# Altium schematic sheet 简单版.SchDoc
size A4
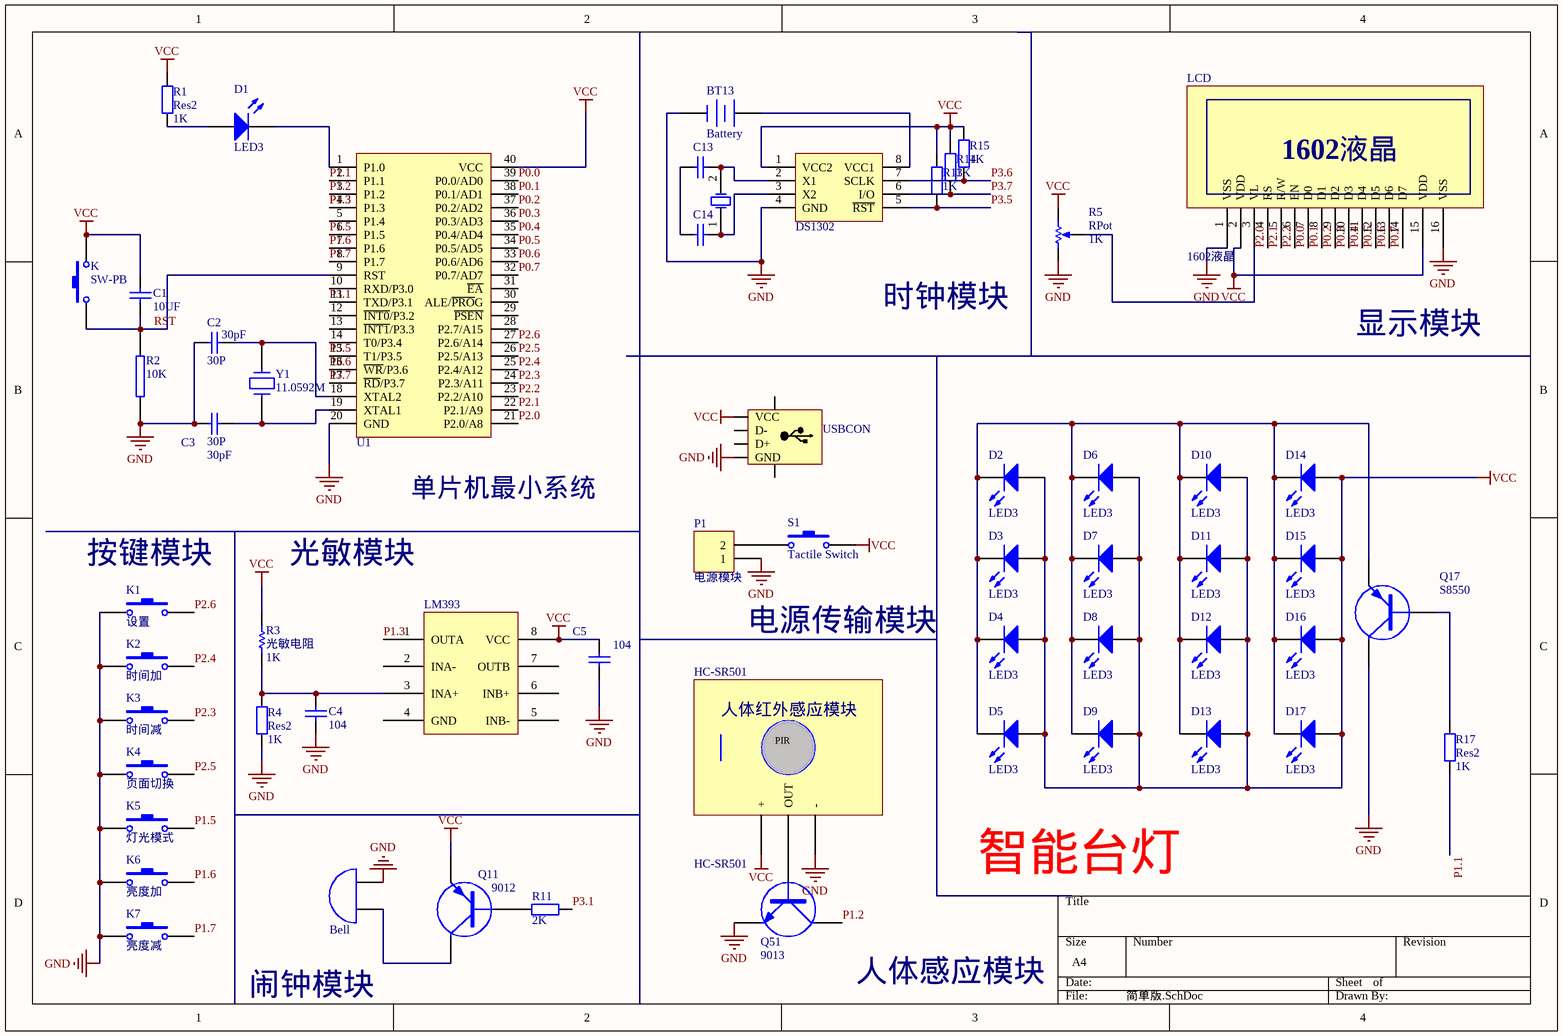
[diagram p0: 简单版.SchDoc]

## Parts
BEEP  Bell  [Beep_small]
BT13  Battery  [Battery_3V固定底座]
C1  10UF  [CAPPR2.5-6.3X5]
C2  30P  value 30pF  [Capacitor-Disk-Large]
C3  30P  value 30pF  [Capacitor-Disk-Large]
C4  104  [CAPPR2.5-6.3X5]
C5  104  [CAPPR2.5-6.3X5]
C13  Cap  [CAP-0.1]  (value not drawn)
C14  Cap  [CAP-0.1]  (value not drawn)
D1  LED3  [LED-R3-H5-SINGLE-R]
D2  LED3  [3.5X2.8X1.9]
D3  LED3  [3.5X2.8X1.9]
D4  LED3  [3.5X2.8X1.9]
D5  LED3  [3.5X2.8X1.9]
D6  LED3  [3.5X2.8X1.9]
D7  LED3  [3.5X2.8X1.9]
D8  LED3  [3.5X2.8X1.9]
D9  LED3  [3.5X2.8X1.9]
D10  LED3  [3.5X2.8X1.9]
D11  LED3  [3.5X2.8X1.9]
D12  LED3  [3.5X2.8X1.9]
D13  LED3  [3.5X2.8X1.9]
D14  LED3  [3.5X2.8X1.9]
D15  LED3  [3.5X2.8X1.9]
D16  LED3  [3.5X2.8X1.9]
D17  LED3  [3.5X2.8X1.9]
HC-SR501  HC-SR501  [HS0038]
K  SW-PB  [BUTTON_6*6]
K1  设置  [BUTTON_6*6]
K2  时间加  [BUTTON_6*6]
K3  时间减  [BUTTON_6*6]
K4  页面切换  [BUTTON_6*6]
K5  灯光模式  [BUTTON_6*6]
K6  亮度加  [BUTTON_6*6]
K7  亮度减  [BUTTON_6*6]
LCD  1602液晶  [LCD1602]
LM393  LM393  [SOIC-8_150mil]  (value not drawn)
P1  电源模块  [POWER]
Q11  9012  [TO-92(TO-92-3)]
Q17  S8550  [TO-92(TO-92-3)]
Q51  9013  [TO-92(TO-92-3)]
R1  Res2  value 1K  [AXIAL-0.4]
R2  10K  [AXIAL-0.4]
R3  光敏电阻  value 1K  [光敏电阻]
R4  Res2  value 1K  [6-0805_N]
R5  RPot  value 1K  [RP-3362]
R11  2K  [AXIAL-0.4]
R13  value 1K  [6-0805_N]  (hidden comment: Res2)
R14  value 1K  [6-0805_N]  (hidden comment: Res2)
R15  value 1K  [6-0805_N]  (hidden comment: Res2)
R17  Res2  value 1K  [AXIAL-0.4]
S1  Tactile Switch  [sw_8.5mm]
U1  AT89C51  [DIP-40]  (value not drawn)
U2  DS1302  [DIP8]
USBCON  USB-4P  [USB-A-SMT]  (value not drawn)
Y1  11.0592M  [XTAL-49/U_N]
Y13  XTAL  [XTAL-1]  (value not drawn)

## Nets
GND: BEEP.2(B) BT13.2(-) C2.1 C3.1 C4.1 C5.1 HC-SR501.56(-) K1.1 K2.1 K3.1 K4.1 K5.1 K6.1 K7.1 LCD.1(VSS) LCD.16(VSS) P1.1 Q17.1(E) Q51.1(E) R2.1 R4.1 R5.1(TOP) U1.20(GND) U2.4(GND) USBCON.4(GND)
VCC: C1.1 C5.2 D2.1(A) D3.1(A) D4.1(A) D5.1(A) D6.1(A) D7.1(A) D8.1(A) D9.1(A) D10.1(A) D11.1(A) D12.1(A) D13.1(A) D14.1(A) D15.1(A) D16.1(A) D17.1(A) HC-SR501.?1(+) K.2 LCD.2(VDD) LCD.15(VDD) LM393.8(VCC) Q11.3(C) R1.2 R3.2 R5.2(BOT) R13.2 R14.2 R15.2 S1.2 U1.40(VCC) U2.1(VCC2) USBCON.1(VCC)
P0.0: LCD.7(D0) U1.39(P0.0/AD0)
P0.1: LCD.8(D1) U1.38(P0.1/AD1)
P0.2: LCD.9(D2) U1.37(P0.2/AD2)
P0.3: LCD.10(D3) U1.36(P0.3/AD3)
P0.4: LCD.11(D4) U1.35(P0.4/AD4)
P0.5: LCD.12(D5) U1.34(P0.5/AD5)
P0.6: LCD.13(D6) U1.33(P0.6/AD6)
P0.7: LCD.14(D7) U1.32(P0.7/AD7)
P1.1: R17.2 U1.2(P1.1)
P1.2: Q51.3(C) U1.3(P1.2)
P1.3: LM393.1(OUTA) U1.4(P1.3)
P1.5: K5.2 U1.6(P1.5)
P1.6: K6.2 U1.7(P1.6)
P1.7: K7.2 U1.8(P1.7)
P2.0: LCD.4(RS) U1.21(P2.0/A8)
P2.1: LCD.5(R/W) U1.22(P2.1/A9)
P2.2: LCD.6(EN) U1.23(P2.2/A10)
P2.3: K3.2 U1.24(P2.3/A11)
P2.4: K2.2 U1.25(P2.4/A12)
P2.5: K4.2 U1.26(P2.5/A13)
P2.6: K1.2 U1.27(P2.6/A14)
P3.1: R11.2 U1.11(TXD/P3.1)
P3.5: R13.1 U1.15(T1/P3.5) U2.5(~{RST})
P3.6: R15.1 U1.16(~{WR}/P3.6) U2.7(SCLK)
P3.7: R14.1 U1.17(~{RD}/P3.7) U2.6(I/O)
RST: C1.2 K.1 R2.2 U1.9(RST)
NetBEEP_1: BEEP.1(A) Q11.1(E)
NetBT13_1: BT13.1(+) U2.8(VCC1)
NetC2_2: C2.2 U1.18(XTAL2) Y1.2
NetC3_2: C3.2 U1.19(XTAL1) Y1.1
NetC4_2: C4.2 LM393.3(INA+) R3.1 R4.2
NetC13_1: C13.1 C14.1
NetC13_2: C13.2 U2.2(X1) Y13.2(OSC2)
NetC14_2: C14.2 U2.3(X2) Y13.1(OSC1)
NetD1_1: D1.1(A) R1.1
NetD1_2: D1.2(K) U1.1(P1.0)
NetD2_2: D2.2(K) D3.2(K) D4.2(K) D5.2(K) D6.2(K) D7.2(K) D8.2(K) D9.2(K) D10.2(K) D11.2(K) D12.2(K) D13.2(K) D14.2(K) D15.2(K) D16.2(K) D17.2(K) Q17.3(C)
NetHC-SR501_55: HC-SR501.55(OUT) Q51.2(B)
NetLCD_3: LCD.3(VL) R5.3(TAP)
NetP1_2: P1.2 S1.1
NetQ11_2: Q11.2(B) R11.1
NetQ17_2: Q17.2(B) R17.1

Not connected (* = marked no-connect by the designer): LM393 2(INA-) 4(GND) 5(INB-) 6(INB+) 7(OUTB); U1 5(P1.4) 10(RXD/P3.0) 12(~{INT0}/P3.2) 13(~{INT1}/P3.3) 14(T0/P3.4) 28(P2.7/A15) 29(~{PSEN}) 30(ALE/~{PRO}G) 31(~{EA}); USBCON 2(D-) 3(D+) 5(GND) 6(GND)

## Notes on the sheet
- 时钟模块
- 显示模块
- (near U1) 单片机最小系统
- (near K1) 按键模块
- 光敏模块
- 电源传输模块
- 智能台灯
- (near Q51) 人体感应模块
- 闹钟模块
- (in symbol HC-SR501) 人体红外感应模块; PIR

## Library data of the parts
BEEP = Bell: Electrical Bell; Published: 24-Mar-1999; LatestRevisionDate: 17-Jul-2002; LatestRevisionNote: Re-released for DXP Platform.; PackageReference: PIN2; Publisher: Altium Limited
BT13 = Battery: Multicell Battery; Published: 24-Mar-1999; LatestRevisionDate: 17-Jul-2002; LatestRevisionNote: Re-released for DXP Platform.; PackageReference: BAT-2; Publisher: Altium Limited; PackageDescription: Battery; 2 Leads
C1-C5 = Cap: Capacitor; Published: 8-Jun-2000; LatestRevisionDate: 17-Jul-2002; LatestRevisionNote: Re-released for DXP Platform.; PackageReference: RAD-0.3; Publisher: Altium Limited
  C1: Value: 10UF
C13 C14 = Cap: Capacitor; Value: 100pF; Published: 8-Jun-2000; LatestRevisionDate: 17-Jul-2002; LatestRevisionNote: Re-released for DXP Platform.; PackageReference: RAD-0.3; Publisher: Altium Limited; PackageDescription: Radial Cap, Thru-Hole; 2 Leads; 0.3 in Pin Spacing
D1-D17 = LED3: Typical BLUE SiC LED; Published: 8-Jun-2000; LatestRevisionDate: 17-Dec-2003; LatestRevisionNote: PCB Footprint replaced.; DatasheetVersion: 16-Apr-2002; PackageVersion: 16-Apr-2002; PackageReference: 3.5X2.8X1.9; Publisher: Altium Limited; PackageDescription: SM LED; 2 C-Bend Leads; Body 3.5 x 2.8 x 1.9 mm, inc leads (LxWxH typ)
K = SW-PB: Switch; Published: 24-Mar-1999; LatestRevisionDate: 17-Jul-2002; LatestRevisionNote: Re-released for DXP Platform.; PackageReference: SPST-2; Publisher: Altium Limited; PackageDescription: Switch; 2 Leads
K1-K7 = 按键
LCD = 1602
P1 = Header 2: Header, 2-Pin; LatestRevisionDate: 17-Jul-2002; LatestRevisionNote: Re-released for DXP Platform.; Publisher: Altium Limited
Q11 Q17 = PNP9012
Q51 = NPN9013
R1 R4 R13-R15 R17 = Res2: Resistor; Published: 8-Jun-2000; LatestRevisionDate: 17-Jul-2002; LatestRevisionNote: Re-released for DXP Platform.; PackageReference: AXIAL-0.4; Publisher: Altium Limited; PackageDescription: Axial Device, Thru-Hole; 2 Leads; 0.4 in Pin Spacing
R2 = RES2
R3 = Res1: Resistor; Published: 8-Jun-2000; LatestRevisionDate: 17-Jul-2002; LatestRevisionNote: Re-released for DXP Platform.; PackageReference: AXIAL-0.3; Publisher: Altium Limited; PackageDescription: Axial Device, Thru-Hole; 2 Leads; 0.3 in Pin Spacing
R5 = RPot: Potentiometer; Sim Note: Enter the Resistance value and the set point into parameter fields.; Set Position: 0.5; Published: 8-Jun-2000; LatestRevisionDate: 17-Jul-2002; LatestRevisionNote: Re-released for DXP Platform.; PackageReference: VR5; Publisher: Altium Limited; PackageDescription: Variable Resistor, Thru-Hole; 3 Leads
R11 = Res2_1W: Resistor 直插电阻 1W; Published: 8-Jun-2000; LatestRevisionDate: 17-Jul-2002; LatestRevisionNote: Re-released for DXP Platform.; PackageReference: AXIAL-0.4; Publisher: Altium Limited; Value: 2K
S1 = SW-PB: Tactile Switch触觉开关; Published: 24-Mar-1999; LatestRevisionDate: 17-Jul-2002; LatestRevisionNote: Re-released for DXP Platform.; PackageReference: SPST-2; Publisher: Altium Limited
U1 = AT89C51-DIP: AT89C51_DIP40
USBCON = USB-4P: USB CONNECTOR
Y1 = CRYSTAL
Y13 = XTAL: Crystal Oscillator; Published: 8-Jun-2000; LatestRevisionDate: 17-Jul-2002; LatestRevisionNote: Re-released for DXP Platform.; PackageReference: R38; Publisher: Altium Limited; PackageDescription: Crystal, Thru-Hole; 2 Leads; Body 3.1 x 8.2 mm (Dia.xH)